# Altium schematic sheet Stick_LPC.SchDoc: Microcontrolador LPC1769
size A4; Author: **; CompanyName: Electrónica Aplicada al Automotor; Organization: UTN FRBA; DocumentNumber: 3; Revision: 00; SheetNumber: 3; SheetTotal: 7; Autor: Badenas, Francisco J. / Ipar, Eugenia
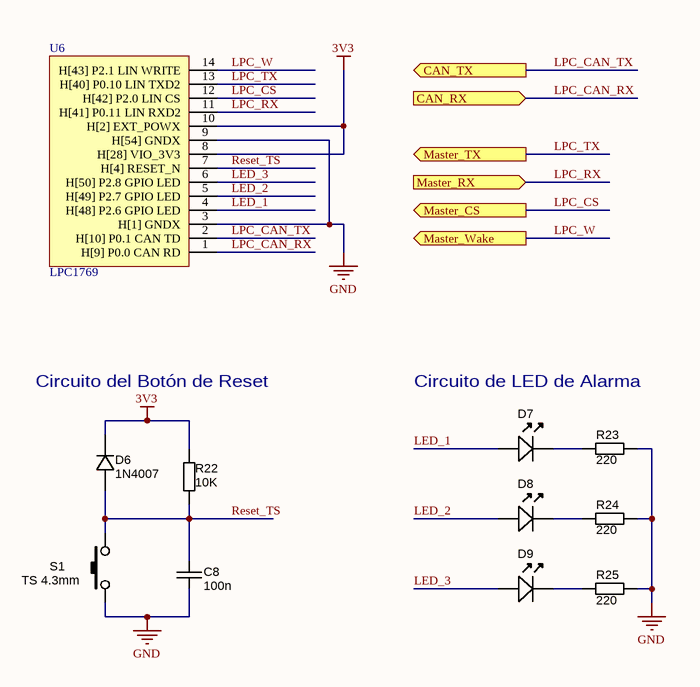
[diagram p0: Stick_LPC.SchDoc]

## Parts
C8  100n  [CAPC1608X90N]
D6  1N4007  [DO-214AC]
D7  Green  [LED-0603-GREEN]  (value not drawn)
D8  Green  [LED-0603-GREEN]  (value not drawn)
D9  Green  [LED-0603-GREEN]  (value not drawn)
R22  10K  [RESC1608N_ZERO]
R23  220  [RESC1608N_ZERO]
R24  220  [RESC1608N_ZERO]
R25  220  [RESC1608N_ZERO]
S1  Manufacturer Part Number 1: TS 4.3mm  [TACT-SWITCH-TS1143]  (hidden comment: SW_THT_PB_4.3mm)
U6  LPC1769  [Header_12]

## Ports
CAN_RX (in), CAN_TX (out), Master_CS (out), Master_RX (in), Master_TX (out), Master_Wake (out)

## Nets
3V3: D6.K R22.1 U6.8(H[28]_VIO_3V3) U6.10(H[2]_EXT_POWX)
GND: C8.2 R23.2 R24.2 R25.2 S1.1 U6.3(H[1]_GNDX) U6.9(H[54]_GNDX)
LED_1: D7.A U6.4(H[48]_P2.6_GPIO_LED)
LED_2: D8.A U6.5(H[49]_P2.7_GPIO_LED)
LED_3: D9.A U6.6(H[50]_P2.8_GPIO_LED)
LPC_CAN_RX: U6.1(H[9]_P0.0_CAN_RD) ; port CAN_RX
LPC_CAN_TX: U6.2(H[10]_P0.1_CAN_TD) ; port CAN_TX
LPC_CS: U6.12(H[42]_P2.0_LIN_CS) ; port Master_CS
LPC_RX: U6.11(H[41]_P0.11_LIN_RXD2) ; port Master_RX
LPC_TX: U6.13(H[40]_P0.10_LIN_TXD2) ; port Master_TX
LPC_W: U6.14(H[43]_P2.1_LIN_WRITE) ; port Master_Wake
Reset_TS: C8.1 D6.A R22.2 S1.2 U6.7(H[4]_RESET_N)
NetD7_K: D7.K R23.1
NetD8_K: D8.K R24.1
NetD9_K: D9.K R25.1

## Notes on the sheet
- Circuito del Botón de Reset
- Circuito de LED de Alarma
- Title:
- Size:
- Author:
- A4
- Sheet
- of
- Revision:
- File:
- Date:

## Library data of the parts
C8 = CAPC_47n_0603_X7R_50V_10%: Capacitor SMD Cer 100nF 10% 50V X7R 0603; Manufacturer 1: AVX Corporation; Manufacturer Part Number 1: 06035C473KAT2A; Ratings: 50V; X7R; Material: ceramic; SCDType: spec; Manufacturer 3: Samsung; Manufacturer Part Number 3: CL10B473KBN; Package / Case: 0603 (1608 metric); Tolerance: ±10%; Supplier 1: Digi-Key; Supplier Part Number 1: 478-5146-1-ND; Manufacturer Part Number 2: C1608X7R1H473K080AA; Manufacturer 2: TDK Corporation; ComponentLink1URL: http://www.avx.com/docs/Catalogs/cx7r.pdf; ComponentLink1Description: http://www.avx.com/docs/Catalogs/cx7r.pdf; Supplier 2: Digi-Key; Supplier Part Number 2: 445-1313-1-ND; ComponentLink2URL: http://product.tdk.com/capacitor/mlcc/en/documents/mlcc_commercial_general_en.pdf; ComponentLink2Description: http://product.tdk.com/capacitor/mlcc/en/documents/mlcc_commercial_general_en.pdf; Value: 100n
D6 = DIODE_100V_1.5A_SMA: Diode 1N4007 SMD DO-214AC 100V 1.5A SMA; Manufacturer 1: Diodes Inc; Ratings: 100V; 1.5A; Material: Si; Diode Type: Standard; Value: Vf = 1.15V @ 1.5A (Max); SCDType: source; Package / Case: DO-214AC, SMA; Supplier 1: Digi-Key; Supplier Part Number 1: S2BA-FDICT-ND; Manufacturer Part Number 1: 1N4007
D7-D9 = LED_SMD_Green_0603_570nm: LED 0603 SMD Green 570nm 50mcd 20mA; Manufacturer 1: Kingbright Company LLC; Manufacturer Part Number 1: APT1608CGCK; Material: AlGaInP; Ratings: 20mcd min; 50 mcd typ; 570 nm; Voltage - Forward (Vf) Typ: 2.1V; Viewing Angle: 120°; Lens Style/Size: Rectangle with Flat Top, 1.1mm x 0.8mm; Voltage - Forward (Vf) @ 10mA: 2.0V; SCDType: source; Wavelength - Peak: 574nm; Lens Type: Clear; Package / Case: 0603 (1608 metric); Color: Green; Current - Test: 20mA; Supplier 1: Digi-Key; Supplier Part Number 1: 754-1116-1-ND; RoHS 1: RoHS Compliant; Wavelength - Dominant: 570nm; ComponentLink1URL: http://www.us.kingbright.com/images/catalog/SPEC/APT1608CGCK.pdf; ComponentLink1Description: http://www.us.kingbright.com/images/catalog/SPEC/APT1608CGCK.pdf
R22 = RES_0R_0603: Resistor SMD 0603 10K 5%; Manufacturer 1: Vishay/Dale; Manufacturer Part Number 1: CRCW06030000Z0EA; Ratings: 1/10W; SCDType: spec; Tolerance: ±5%; Package / Case: 0603 (1608metric); Supplier 1: Digi-Key; Supplier Part Number 1: 541-0.0GCT-ND; ComponentLink1URL: http://www.vishay.com/doc?20035; ComponentLink1Description: http://www.vishay.com/doc?20035; Supplier 2: Digi-Key; Supplier Part Number 2: P0.0GTR-ND; Manufacturer 2: Panasonic Electronic Components; Manufacturer Part Number 2: ERJ-3GEY0R00V; RoHS 2: RoHS Compliant; ComponentLink2URL: http://industrial.panasonic.com/www-cgi/jvcr13pz.cgi?E+PZ+3+AOA0001+ERJ3GEY0R00V+7+WW; ComponentLink2Description: http://industrial.panasonic.com/www-cgi/jvcr13pz.cgi?E+PZ+3+AOA0001+ERJ3GEY0R00V+7+WW; Supplier 3: Digi-Key; Supplier Part Number 3: 311-0.0LECT-ND; Manufacturer 3: Yageo; Manufacturer Part Number 3: AC0603JR-070RL; RoHS 3: RoHS Compliant; ComponentLink3URL: http://www.yageo.com/documents/recent/PYu-AC_51_RoHS_L_2.pdf; ComponentLink3Description: http://www.yageo.com/documents/recent/PYu-AC_51_RoHS_L_2.pdf; Value: 10K
R23-R25 = RES_0R_0603: Resistor SMD 0603 220 Ohm 5%; Manufacturer 1: Vishay/Dale; Manufacturer Part Number 1: CRCW06030000Z0EA; Ratings: 1/10W; SCDType: spec; Tolerance: ±5%; Package / Case: 0603 (1608metric); Supplier 1: Digi-Key; Supplier Part Number 1: 541-0.0GCT-ND; ComponentLink1URL: http://www.vishay.com/doc?20035; ComponentLink1Description: http://www.vishay.com/doc?20035; Supplier 2: Digi-Key; Supplier Part Number 2: P0.0GTR-ND; Manufacturer 2: Panasonic Electronic Components; Manufacturer Part Number 2: ERJ-3GEY0R00V; RoHS 2: RoHS Compliant; ComponentLink2URL: http://industrial.panasonic.com/www-cgi/jvcr13pz.cgi?E+PZ+3+AOA0001+ERJ3GEY0R00V+7+WW; ComponentLink2Description: http://industrial.panasonic.com/www-cgi/jvcr13pz.cgi?E+PZ+3+AOA0001+ERJ3GEY0R00V+7+WW; Supplier 3: Digi-Key; Supplier Part Number 3: 311-0.0LECT-ND; Manufacturer 3: Yageo; Manufacturer Part Number 3: AC0603JR-070RL; RoHS 3: RoHS Compliant; ComponentLink3URL: http://www.yageo.com/documents/recent/PYu-AC_51_RoHS_L_2.pdf; ComponentLink3Description: http://www.yageo.com/documents/recent/PYu-AC_51_RoHS_L_2.pdf; Value: 220
S1 = SW_THT_PB_4.3mm: Switch, tact, 4.3mm stem; Manufacturer 1: Bond-Tact; Function: Speed; SCDType: spec; Package / Case: 6.5x6.5mm; 4.3mm stem; Material: Brass/Nylon/Ag plating
U6 = LPC1769_Pinera: LPC1769 Pinera 5mm